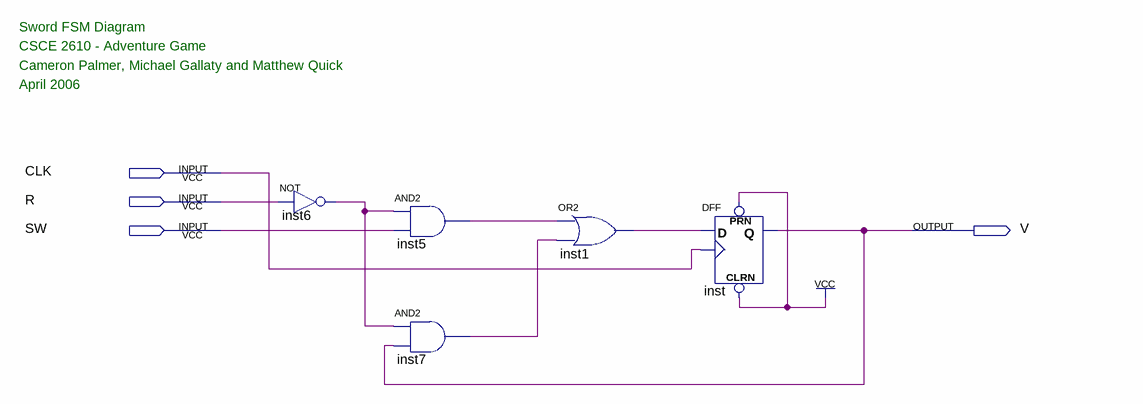
[diagram p0: schematic sheet]
// Quartus schematic sword_fsm.bdf as structural Verilog: 5 symbols, 4 pins
module sword_fsm (
  input  CLK,
  input  R,
  input  SW,
  output V
);

  wire inst1_out, inst5_out, inst6_out, inst7_out;

  not inst6 (inst6_out, R);
  and inst5 (inst5_out, inst6_out, SW);
  and inst7 (inst7_out, inst6_out, V);
  or inst1 (inst1_out, inst5_out, inst7_out);
  DFF inst (.CLRN(1'b1), .CLK(CLK), .D(inst1_out), .PRN(1'b1), .Q(V));

  // Notes on the sheet:
  //   Sword FSM Diagram
  //   CSCE 2610 - Adventure Game
  //   Cameron Palmer, Michael Gallaty and Matthew Quick
  //   April 2006
endmodule
